# Altium schematic sheet Trinamic.SchDoc
size 420 x 297 mm; SheetNumber: 7; SheetTotal: 14; PageSetup: Record=PageOptions|CenterHorizontal=True|CenterVertical=True|PrintScale=0.96|XCorrection=1.00|YCorrection=1.00|PrintKind=1|BorderSize=5000000|LeftOffset=0|BottomOffset=0|Orientation=2|PaperLength=4318|PaperWidth=2794|Scale=100|PaperSource=7|PrintQuality=600|MediaType=1|DitherType=10|PaperKind=11" x 17"|PrintScaleMode=1
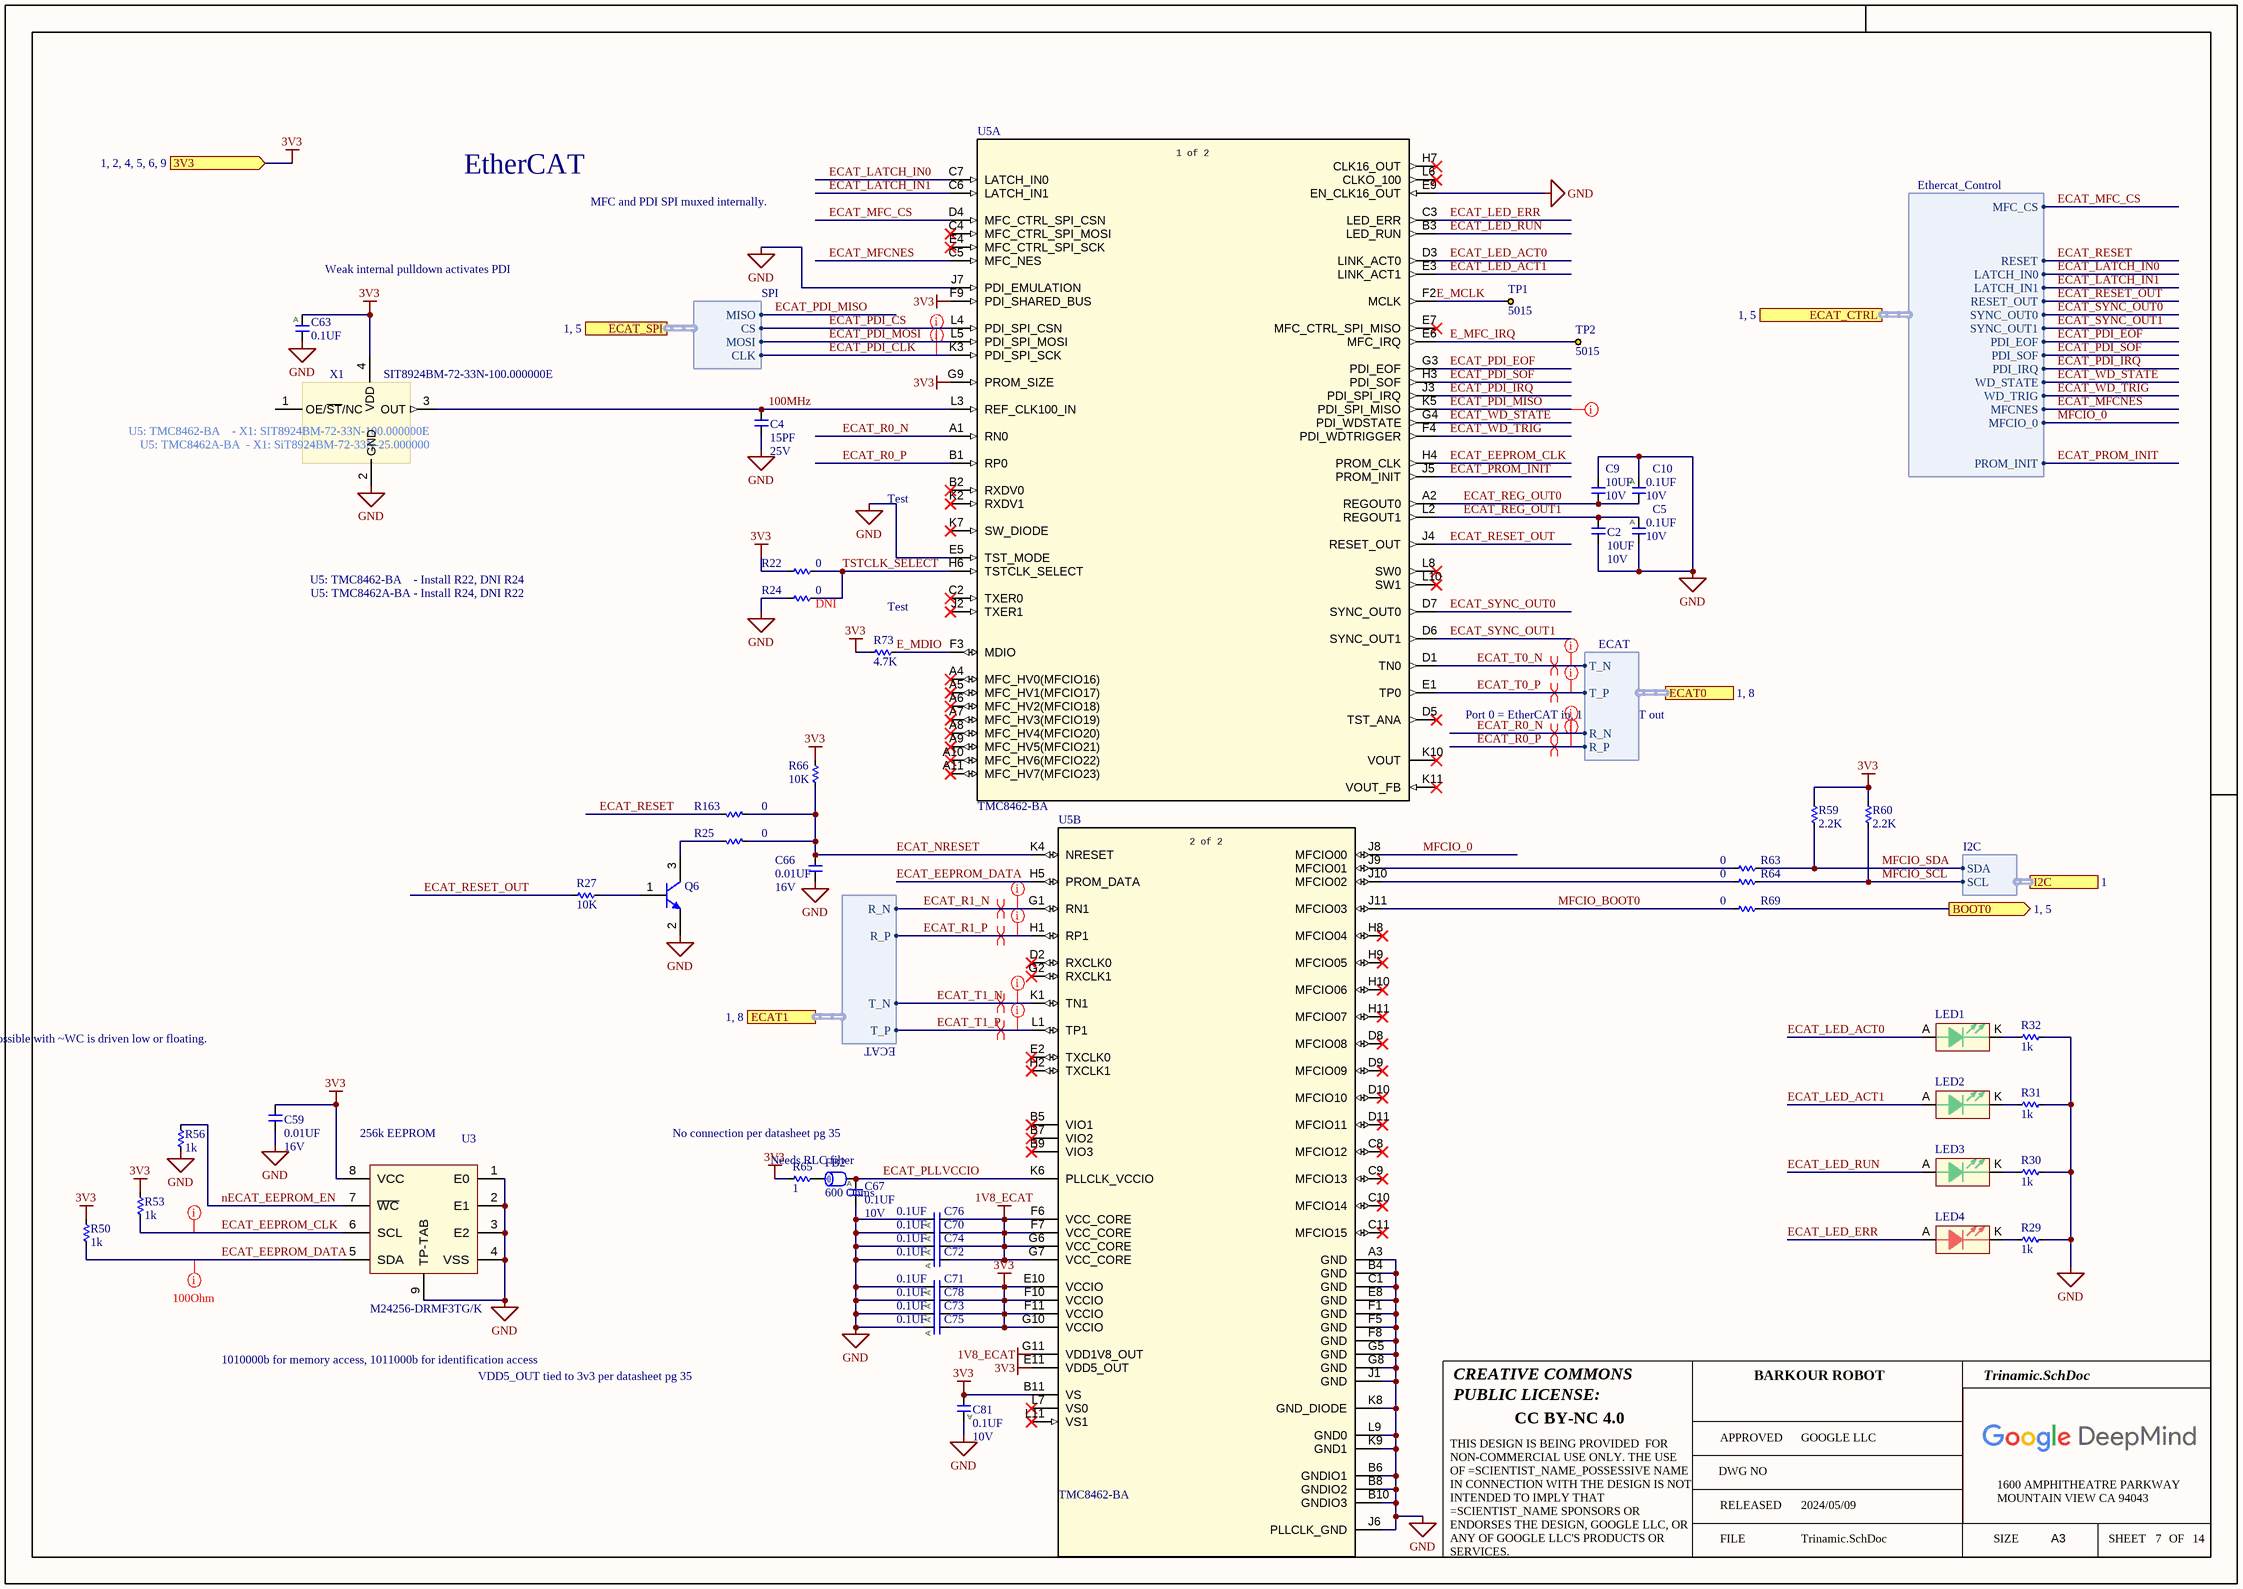
[diagram p0: Trinamic.SchDoc]

## Parts
C2  value 10UF  Voltage: 10V  [C0402]  (hidden comment: __Template_Cap)
C4  value 15PF  Voltage: 25V  [C0201]  (hidden comment: __Template_Cap)
C5  value 0.1UF  Voltage: 10V  [C0201]  (hidden comment: __Template_Cap_Auto)
C9  value 10UF  Voltage: 10V  [C0402]  (hidden comment: __Template_Cap)
C10  value 0.1UF  Voltage: 10V  [C0201]  (hidden comment: __Template_Cap_Auto)
C59  value 0.01UF  Voltage: 16V  [C0201]  (hidden comment: __Template_Cap)
C63  value 0.1UF  [C0201]  (hidden comment: __Template_Cap_Auto)
C66  value 0.01UF  Voltage: 16V  [C0201]  (hidden comment: __Template_Cap)
C67  value 0.1UF  Voltage: 10V  [C0201]  (hidden comment: __Template_Cap_Auto)
C70  value 0.1UF  [C0201]  (hidden comment: __Template_Cap_Auto)
C71  value 0.1UF  [C0201]  (hidden comment: __Template_Cap_Auto)
C72  value 0.1UF  [C0201]  (hidden comment: __Template_Cap_Auto)
C73  value 0.1UF  [C0201]  (hidden comment: __Template_Cap_Auto)
C74  value 0.1UF  [C0201]  (hidden comment: __Template_Cap_Auto)
C75  value 0.1UF  [C0201]  (hidden comment: __Template_Cap_Auto)
C76  value 0.1UF  [C0201]  (hidden comment: __Template_Cap_Auto)
C78  value 0.1UF  [C0201]  (hidden comment: __Template_Cap_Auto)
C81  value 0.1UF  Voltage: 10V  [C0201]  (hidden comment: __Template_Cap_Auto)
FB2  value 600 Ohms  [L0201_H0.33MM]  (hidden comment: __Template_Ferrite_Bead)
LED1  __Template_LED_GREEN_AK  [LED_APHHS1005LCGCK]  (value not drawn)
LED2  __Template_LED_GREEN_AK  [LED_APHHS1005LCGCK]  (value not drawn)
LED3  __Template_LED_GREEN_AK  [LED_APHHS1005LCGCK]  (value not drawn)
LED4  __Template_LED_RED_AK  [LED_APHHS1005LCGCK]  (value not drawn)
Q6  Bipolar NPN 3 Pins Transistor Gummel-Poon Model  [SOT23-3]  (value not drawn)
R22  0  [R0402]
R24  0  [R0402]
R25  0  [R0402]
R27  value 10K  [R0201]  (hidden comment: __Template_Resistor)
R29  value 1k  [R0201]  (hidden comment: __Template_Resistor)
R30  value 1k  [R0201]  (hidden comment: __Template_Resistor)
R31  value 1k  [R0201]  (hidden comment: __Template_Resistor)
R32  value 1k  [R0201]  (hidden comment: __Template_Resistor)
R50  value 1k  [R0201]  (hidden comment: __Template_Resistor)
R53  value 1k  [R0201]  (hidden comment: __Template_Resistor)
R56  value 1k  [R0201]  (hidden comment: __Template_Resistor)
R59  2.2K  [R0201]
R60  2.2K  [R0201]
R63  0  [R0402]
R64  0  [R0402]
R65  1  [R0201]
R66  value 10K  [R0201]  (hidden comment: __Template_Resistor)
R69  0  [R0402]
R73  value 4.7K  [R0201]  (hidden comment: __Template_Resistor)
R163  0  [R0402]
TP1  MFG P/N: 5015  [TP_KEYSTONE_5015]  (hidden comment: TP_KEYSTONE_5015)
TP2  MFG P/N: 5015  [TP_KEYSTONE_5015]  (hidden comment: TP_KEYSTONE_5015)
U3  MFG P/N: M24256-DRMF3TG/K  [8WFDFN300X200X80-8-TP]  (hidden comment: EEPROM_M24256-DRMF3TG/K)
U5  MFG P/N: TMC8462-BA  [BGA121C75P11X11_900X900X145]  (hidden comment: PROCESSOR_TRINAMIC_TMC8462-BA)  (parts A,B of 2)
X1  Mfg P/N: SIT8924BM-72-33N-100.000000E  [XTAL_SIT8924BM-72-33N-100.000000]  (hidden comment: XTAL_SIT8924BM-72-33N-100.000000)

## Ports
3V3 (in, see 1, 2, 4, 5, 6, 9), BOOT0 (out, see 1, 5), ECAT0 (harness ECAT, see 1, 8), ECAT1 (harness ECAT, see 1, 8), ECAT_CTRL (harness Ethercat_Control, see 1, 5), ECAT_SPI (harness SPI, see 1, 5), I2C (harness I2C, see 1)

## Harnesses
Ethercat_Control: MFC_CS, LATCH_IN0, LATCH_IN1, RESET_OUT, SYNC_OUT0, SYNC_OUT1, PDI_EOF, PDI_SOF, PDI_IRQ, RESET, WD_STATE, WD_TRIG, MFCNES, MFCIO_0, PROM_INIT
SPI: MISO, MOSI, CS, CLK
ECAT: R_P, R_N, T_P, T_N
I2C: SDA, SCL

## Nets
1V8_ECAT: C70.2 C72.2 C74.2 C76.2 U5.F6(VCC_CORE) U5.F7(VCC_CORE) U5.G6(VCC_CORE) U5.G7(VCC_CORE) U5.G11(VDD1V8_OUT)
3V3: C59.1 C63.1 C71.2 C73.2 C75.2 C78.2 C81.2 R22.1 R50.2 R53.2 R59.2 R60.2 R65.1 R66.2 R73.2 U3.8(VCC) U5.B11(VS) U5.E10(VCCIO) U5.E11(VDD5_OUT) U5.F9(PDI_SHARED_BUS) U5.F10(VCCIO) U5.F11(VCCIO) U5.G9(PROM_SIZE) U5.G10(VCCIO) X1.4(VDD) ; port 3V3
GND: C2.2 C4.2 C5.2 C9.1 C10.1 C59.2 C63.2 C66.2 C67.2 C70.1 C71.1 C72.1 C73.1 C74.1 C75.1 C76.1 C78.1 C81.1 Q6.2(E) R24.1 R29.1 R30.1 R31.1 R32.1 R56.1 U3.1(E0) U3.2(E1) U3.3(E2) U3.4(VSS) U3.9(TP-TAB) U5.A3(GND) U5.B4(GND) U5.B6(GNDIO1) U5.B8(GNDIO2) U5.B10(GNDIO3) U5.C1(GND) U5.E5(TST_MODE) U5.E8(GND) U5.E9(EN_CLK16_OUT) U5.F1(GND) U5.F5(GND) U5.F8(GND) U5.G5(GND) U5.G8(GND) U5.J1(GND) U5.J6(PLLCLK_GND) U5.J7(PDI_EMULATION) U5.K8(GND_DIODE) U5.K9(GND1) U5.L9(GND0) X1.2(GND)
100MHz: C4.1 U5.L3(REF_CLK100_IN) X1.3(OUT)
BOOT0: R69.2 ; port BOOT0
E_MCLK: TP1.1 U5.F2(MCLK)
E_MDIO: R73.1 U5.F3(MDIO)
E_MFC_IRQ: TP2.1 U5.E6(MFC_IRQ)
ECAT_EEPROM_CLK: R53.1 U3.6(SCL) U5.H4(PROM_CLK)
ECAT_EEPROM_DATA: R50.1 U3.5(SDA) U5.H5(PROM_DATA)
ECAT_LATCH_IN0: U5.C7(LATCH_IN0) ; port ECAT_CTRL.LATCH_IN0
ECAT_LATCH_IN1: U5.C6(LATCH_IN1) ; port ECAT_CTRL.LATCH_IN1
ECAT_LED_ACT0: LED1.A U5.D3(LINK_ACT0)
ECAT_LED_ACT1: LED2.A U5.E3(LINK_ACT1)
ECAT_LED_ERR: LED4.A U5.C3(LED_ERR)
ECAT_LED_RUN: LED3.A U5.B3(LED_RUN)
ECAT_MFC_CS: U5.D4(MFC_CTRL_SPI_CSN) ; port ECAT_CTRL.MFC_CS
ECAT_MFCNES: U5.C5(MFC_NES) ; port ECAT_CTRL.MFCNES
ECAT_NRESET: C66.1 R25.1 R66.1 R163.1 U5.K4(NRESET)
ECAT_PDI_CLK: U5.K3(PDI_SPI_SCK) ; port ECAT_SPI.CLK
ECAT_PDI_CS: U5.L4(PDI_SPI_CSN) ; port ECAT_SPI.CS
ECAT_PDI_EOF: U5.G3(PDI_EOF) ; port ECAT_CTRL.PDI_EOF
ECAT_PDI_IRQ: U5.J3(PDI_SPI_IRQ) ; port ECAT_CTRL.PDI_IRQ
ECAT_PDI_MISO: U5.K5(PDI_SPI_MISO) ; port ECAT_SPI.MISO
ECAT_PDI_MOSI: U5.L5(PDI_SPI_MOSI) ; port ECAT_SPI.MOSI
ECAT_PDI_SOF: U5.H3(PDI_SOF) ; port ECAT_CTRL.PDI_SOF
ECAT_PLLVCCIO: C67.1 FB2.2 U5.K6(PLLCLK_VCCIO)
ECAT_PROM_INIT: U5.J5(PROM_INIT) ; port ECAT_CTRL.PROM_INIT
ECAT_R0_N: U5.A1(RN0) ; port ECAT0.R_N
ECAT_R0_P: U5.B1(RP0) ; port ECAT0.R_P
ECAT_R1_N: U5.G1(RN1) ; port ECAT1.R_N
ECAT_R1_P: U5.H1(RP1) ; port ECAT1.R_P
ECAT_REG_OUT0: C9.2 C10.2 U5.A2(REGOUT0)
ECAT_REG_OUT1: C2.1 C5.1 U5.L2(REGOUT1)
ECAT_RESET: R163.2 ; port ECAT_CTRL.RESET
ECAT_RESET_OUT: R27.2 U5.J4(RESET_OUT) ; port ECAT_CTRL.RESET_OUT
ECAT_SYNC_OUT0: U5.D7(SYNC_OUT0) ; port ECAT_CTRL.SYNC_OUT0
ECAT_SYNC_OUT1: U5.D6(SYNC_OUT1) ; port ECAT_CTRL.SYNC_OUT1
ECAT_T0_N: U5.D1(TN0) ; port ECAT0.T_N
ECAT_T0_P: U5.E1(TP0) ; port ECAT0.T_P
ECAT_T1_N: U5.K1(TN1) ; port ECAT1.T_N
ECAT_T1_P: U5.L1(TP1) ; port ECAT1.T_P
ECAT_WD_STATE: U5.G4(PDI_WDSTATE) ; port ECAT_CTRL.WD_STATE
ECAT_WD_TRIG: U5.F4(PDI_WDTRIGGER) ; port ECAT_CTRL.WD_TRIG
MFCIO_0: U5.J8(MFCIO00) ; port ECAT_CTRL.MFCIO_0
MFCIO_BOOT0: R69.1 U5.J11(MFCIO03)
MFCIO_SCL: R60.1 R64.2 ; port I2C.SCL
MFCIO_SDA: R59.1 R63.2 ; port I2C.SDA
nECAT_EEPROM_EN: R56.2 U3.7(~{WC})
TSTCLK_SELECT: R22.2 R24.2 U5.H6(TSTCLK_SELECT)
NetFB2_1: FB2.1 R65.2
NetLED1_K: LED1.K R32.2
NetLED2_K: LED2.K R31.2
NetLED3_K: LED3.K R30.2
NetLED4_K: LED4.K R29.2
NetQ6_1: Q6.1(B) R27.1
NetQ6_3: Q6.3(C) R25.2
NetR63_1: R63.1 U5.J9(MFCIO01)
NetR64_1: R64.1 U5.J10(MFCIO02)

Not connected (* = marked no-connect by the designer): U5 A4(MFC_HV0(MFCIO16))* A5(MFC_HV1(MFCIO17))* A6(MFC_HV2(MFCIO18))* A7(MFC_HV3(MFCIO19))* A8(MFC_HV4(MFCIO20))* A9(MFC_HV5(MFCIO21))* A10(MFC_HV6(MFCIO22))* A11(MFC_HV7(MFCIO23))* B2(RXDV0)* B5(VIO1)* B7(VIO2)* B9(VIO3)* C2(TXER0)* C4(MFC_CTRL_SPI_MOSI)* C8(MFCIO12)* C9(MFCIO13)* C10(MFCIO14)* C11(MFCIO15)* D2(RXCLK0)* D5(TST_ANA)* D8(MFCIO08)* D9(MFCIO09)* D10(MFCIO10)* D11(MFCIO11)* E2(TXCLK0)* E4(MFC_CTRL_SPI_SCK)* E7(MFC_CTRL_SPI_MISO)* G2(RXCLK1)* H2(TXCLK1)* H7(CLK16_OUT)* H8(MFCIO04)* H9(MFCIO05)* H10(MFCIO06)* H11(MFCIO07)* J2(TXER1)* K2(RXDV1)* K7(SW_DIODE)* K10(VOUT)* K11(VOUT_FB)* L6(CLKO_100)* L7(VS0)* L8(SW0)* L10(SW1)* L11(VS1)*; X1 1(OE/~{ST}/NC)

## Layout directives
net class SE50Ohm: ECAT_PDI_CLK, ECAT_PDI_MISO, ECAT_PDI_MOSI
net class Diff100Ohm: ECAT_R0_N, ECAT_R0_P, ECAT_R1_N, ECAT_R1_P, ECAT_T0_N, ECAT_T0_P, ECAT_T1_N, ECAT_T1_P
differential pair; differential pair class 100Ohm: ECAT_R0_N, ECAT_R0_P, ECAT_R1_N, ECAT_R1_P, ECAT_T0_N, ECAT_T0_P, ECAT_T1_N, ECAT_T1_P
net class SE100Ohm: ECAT_EEPROM_CLK, ECAT_EEPROM_DATA

## Notes on the sheet
- EtherCAT
- (near U5) MFC and PDI SPI muxed internally.
- Weak internal pulldown activates PDI
- U5: TMC8462-BA    - X1: SIT8924BM-72-33N-100.000000E
- (near X1) U5: TMC8462A-BA  - X1: SiT8924BM-72-33N-25.000000
- (near U5) Test
- U5: TMC8462-BA    - Install R22, DNI R24
- U5: TMC8462A-BA - Install R24, DNI R22
- Test
- Port 0 = EtherCAT in, 1 = EtherCAT out
- Writes are possible with ~WC is driven low or floating.
- (near U3) 256k EEPROM
- (near U5) No connection per datasheet pg 35
- Needs RLC filter
- 1010000b for memory access, 1011000b for identification access
- VDD5_OUT tied to 3v3 per datasheet pg 35
- CREATIVE COMMONS
- PUBLIC LICENSE:
- BARKOUR ROBOT
- CC BY-NC 4.0
- APPROVED
- DWG NO
- GOOGLE LLC
- FILE
- RELEASED
- 2024/05/09
- SIZE
- 1600 AMPHITHEATRE PARKWAY
- MOUNTAIN VIEW CA 94043
- A3
- SHEET
- OF
- THIS DESIGN IS BEING PROVIDED  FOR NON-COMMERCIAL USE ONLY. THE USE OF =SCIENTIST_NAME_POSSESSIVE NAME IN CONNECTION WITH THE DESIGN IS NOT INTENDED TO IMPLY THAT =SCIENTIST_NAME SPONSORS OR ENDORSES THE DESIGN, GOOGLE LLC, OR ANY OF GOOGLE LLC'S PRODUCTS OR SERVICES.
- (in symbol 113, part A) 1 of 2
- (in symbol 113, part B) 2 of 2
- (in symbol 934) A

## Library data of the parts
C2 C9 = 215: CAP, CER, X5R, 10uF, 10V, 20%, 0402, 0.7mm T; MFG: SAMSUNG; MFG P/N: CL05A106MP5NUNC; COMMON: 150-00376-00; Status: Released; Package: 0402; Supplier 1: Digi-Key; ComponentLink1URL: https://www.digikey.com/en/products/detail/samsung-electro-mechanics/CL05A106MP5NUNC/3887108; Supplier Part Number 1: 1276-1450-1-ND
C4 = 1033: CAP, CER, NP0, 15pF, 25V, 5%, 0201, 0.9mm T; MFG: TDK; MFG P/N: C0603C0G1E150J030BA; COMMON: 150-00968-00; Status: NRND; Package: 0201; Supplier 1: Digi-Key; ComponentLink1URL: https://www.digikey.com/en/products/detail/tdk-corporation/C0603C0G1E150J030BA/2050004; Supplier Part Number 1: 445-4655-1-ND
C5 C10 C63 C67 C70-C76 C78 C81 = 934: CAP, CER, X6S, 0.1uF, 10V, 10%, 0201, AUTOGRADE; MFG: MURATA; MFG P/N: GRT033C81A104KE01D; COMMON: 150-01178-00; Status: Released; Package: 0201; Supplier 1: Digi-key; ComponentLink1URL: https://search.murata.co.jp/Ceramy/image/img/A01X/G101/ENG/GRT033C81A104KE01-01.pdf; Supplier Part Number 1: 490-12232-1-ND
  C63 C70-C76 C78: Voltage: 10V
C59 C66 = 361: CAP, CER, X5R, 0.01uF, 16V, 10%, 0201, 0.33mm T; MFG: MURATA; MFG P/N: GRM033R61C103KA12D; COMMON: 150-00126-00; Status: Released; Package: 0201; Supplier 1: Digi-Key; ComponentLink1URL: https://www.digikey.com/en/products/detail/murata-electronics/GRM033R61C103KA12D/4213197; Supplier Part Number 1: 490-7223-1-ND
FB2 = 867: FERRITE, BEAD, 600OHMS @100MHZ, 25%, 250mA, 900 mOHM DCR, 0201; MFG: Murata Electronics North America; MFG P/N: BLM03AX601SN1D; Status: Released; Package: 0201 (0603 Metric); Supplier 1: Digi-Key; ComponentLink1URL: https://www.murata.com/en-us/products/productdata/8796741140510/ENFA0020.pdf; Supplier Part Number 1: 490-5624-1-ND
LED1-LED3 = 306: LED, GREEN, 574nm, 2mA, CLEAR, 0402; MFG: Kingbright; MFG P/N: APHHS1005LCGCK; Value: APHHS1005LCGCK; Status: Released; Package: 0402; Supplier 1: Digi-Key; ComponentLink1URL: http://www.kingbrightusa.com/images/catalog/SPEC/APHHS1005LCGCK.pdf; Supplier Part Number 1: 754-2121-1-ND
LED4 = 309: LED, RED, 640NM, 2mA, CLEAR, 0402; MFG: Kingbright; MFG P/N: APHHS1005LSECK/J3-PF; Value: APHHS1005LSECK/J3-PF; Status: Released; Package: 0402; Supplier 1: Digi-Key; ComponentLink1URL: http://www.kingbrightusa.com/images/catalog/SPEC/APHHS1005LSECK-J3-PF.pdf; Supplier Part Number 1: 754-2123-1-ND
Q6 = BJT NPN_GP: TRANS NPN 40V 0.2A SOT23-3; MFG: NTE Electronics, Inc; MFG P/N: MMBT3904; Value: MMBT3904; ComponentLink1URL: https://www.digikey.com/en/products/detail/nte-electronics-inc/MMBT3904/11649623; Package: SOT23-3; Status: Preliminary; Supplier 1: Digi-Key; Supplier Part Number 1: 2368-MMBT3904-ND
R22 R24 R25 R63 R64 R69 R163 = 8004: RES, 0, JUMPER, 1/16W, 0402; MFG: YAGEO; MFG P/N: RC0402FR-070RL; COMMON: 470-02332-00; Status: Released; Package: 0402; Value: 0; Supplier 1: Digi-Key; ComponentLink1URL: https://www.digikey.com/en/products/detail/yageo/RC0402FR-070RL/2827570; Supplier Part Number 1: 311-0.0LRCT-ND
  R24: DNI: DNI
R27 R66 = 6783: RES, 10K, 1%, 1/20W, 0201, AUTOGRADE; MFG: PANASONIC; MFG P/N: ERJ1GNF1002C; COMMON: 470-00033-00; Status: Released; Package: 0201; Supplier 1: Digi-Key; ComponentLink1URL: https://industrial.panasonic.com/cdbs/www-data/pdf/RDA0000/AOA0000C304.pdf; Supplier Part Number 1: P122414CT-ND
R29-R32 R50 R53 R56 = 10010: RES, 1K, 1%, 1/20W, 0201, AUTOGRADE; MFG: Bourns Inc.; MFG P/N: CR0201AFW-1001GLF; Status: Released; Package: 0201; Supplier 1: Digi-Key; ComponentLink1URL: https://www.bourns.com/docs/product-datasheets/crxxxxa.pdf; Supplier Part Number 1: 118-CR0201AFW-1001GLFCT-ND
R59 R60 = 3569: Resistor, 2.20K Ohms, 0201, 0.05W, ±1%; MFG: PANASONIC; MFG P/N: ERJ-1GNF2201C; Status: Released; Package: 0201; Value: 2.2K; Supplier 1: Digi-Key; ComponentLink1URL: https://www.digikey.com/en/products/detail/panasonic-electronic-components/ERJ-1GNF2201C/8342603; Supplier Part Number 1: P122832CT-ND
R65 = 7413: RES, 1.0, 5%, 1/20W, 0201; MFG: PANASONIC; MFG P/N: ERJ-1GNJ1R0C; Status: released; Package: 0201; Value: 1; Supplier 1: Digi-Key; ComponentLink1URL: https://www.digikey.com/en/products/detail/panasonic-electronic-components/ERJ-1GNJ1R0C/2035715; Supplier Part Number 1: P123262CT-ND
R73 = 10025: RES, 4.7K, 1%, 1/20W, 0201, AUTOGRADE; MFG: Panasonic Electronic Components; MFG P/N: ERJ-1GNF4701C; Status: Released; Package: 0201; Supplier 1: Digi-Key; ComponentLink1URL: https://industrial.panasonic.com/cdbs/www-data/pdf/RDA0000/AOA0000C304.pdf; Supplier Part Number 1: P123031CT-ND
TP1 TP2 = 176: PC TEST POINT MINIATURE SMT; MFG: Keystone Electronics; COMMON: 250-00207-00; Value: 5015; Status: In Development; Supplier 1: Digi-Key; ComponentLink1URL: http://mail.keyelco.com/ENG._DEPT/PDF%20CAT%20NO%20Drawings/5015.pdf; Supplier Part Number 1: 36-5015CT-ND
U3 = 423: IC, MEMORY, M24256, EEPROM, 256Kb, I2C, 1MHz, MLP-8, AUTOGRADE; MFG: STMicroelectronics; Status: Released; Package: 8-WFDFN; Supplier 1: Digi-Key; ComponentLink1URL: https://www.st.com/content/ccc/resource/technical/document/datasheet/a7/9b/dd/87/57/59/41/8c/DM00061669.pdf/files/DM00061669.pdf/jcr:content/translations/en.DM00061669.pdf; Supplier Part Number 1: 497-15355-6-ND; Value: M24256-DRMF3TG/K
U5 = 113: IC, CONTROLLER, TMC8462, ETHERNET, 100Mb, SPI, PWM O/P, 100mA, BGA-121; MFG: Trinamic Motion Control GmbH; Status: Released; Package: 121-BGA (9x9); Supplier 1: Digi-Key; ComponentLink1URL: https://www.trinamic.com/products/integrated-circuits/details/tmc8462-ba/; Supplier Part Number 1: 1460-1258-ND; Value: TMC8462-BA
X1 = 137: OSC, MEMS, XO, 100MHZ, +/-25PPM STAB, LVCMOS, 3.3V, SMD-4, AUTOGRADE; Mfg: SiTIME; Status: Released; Package: 4-SMD, No Lead; Supplier 1: Digi-Key; ComponentLink1URL: https://source.z2data.com/2019/9/26/1/9/50/497/69995916/SiT8924.pdf; Supplier Part Number 1: 1473-SIT8924BM-72-33N-100.000000E-ND; Value: 100MHZ